# EAGLE design gsm_lora (EAGLE 9.2.0)
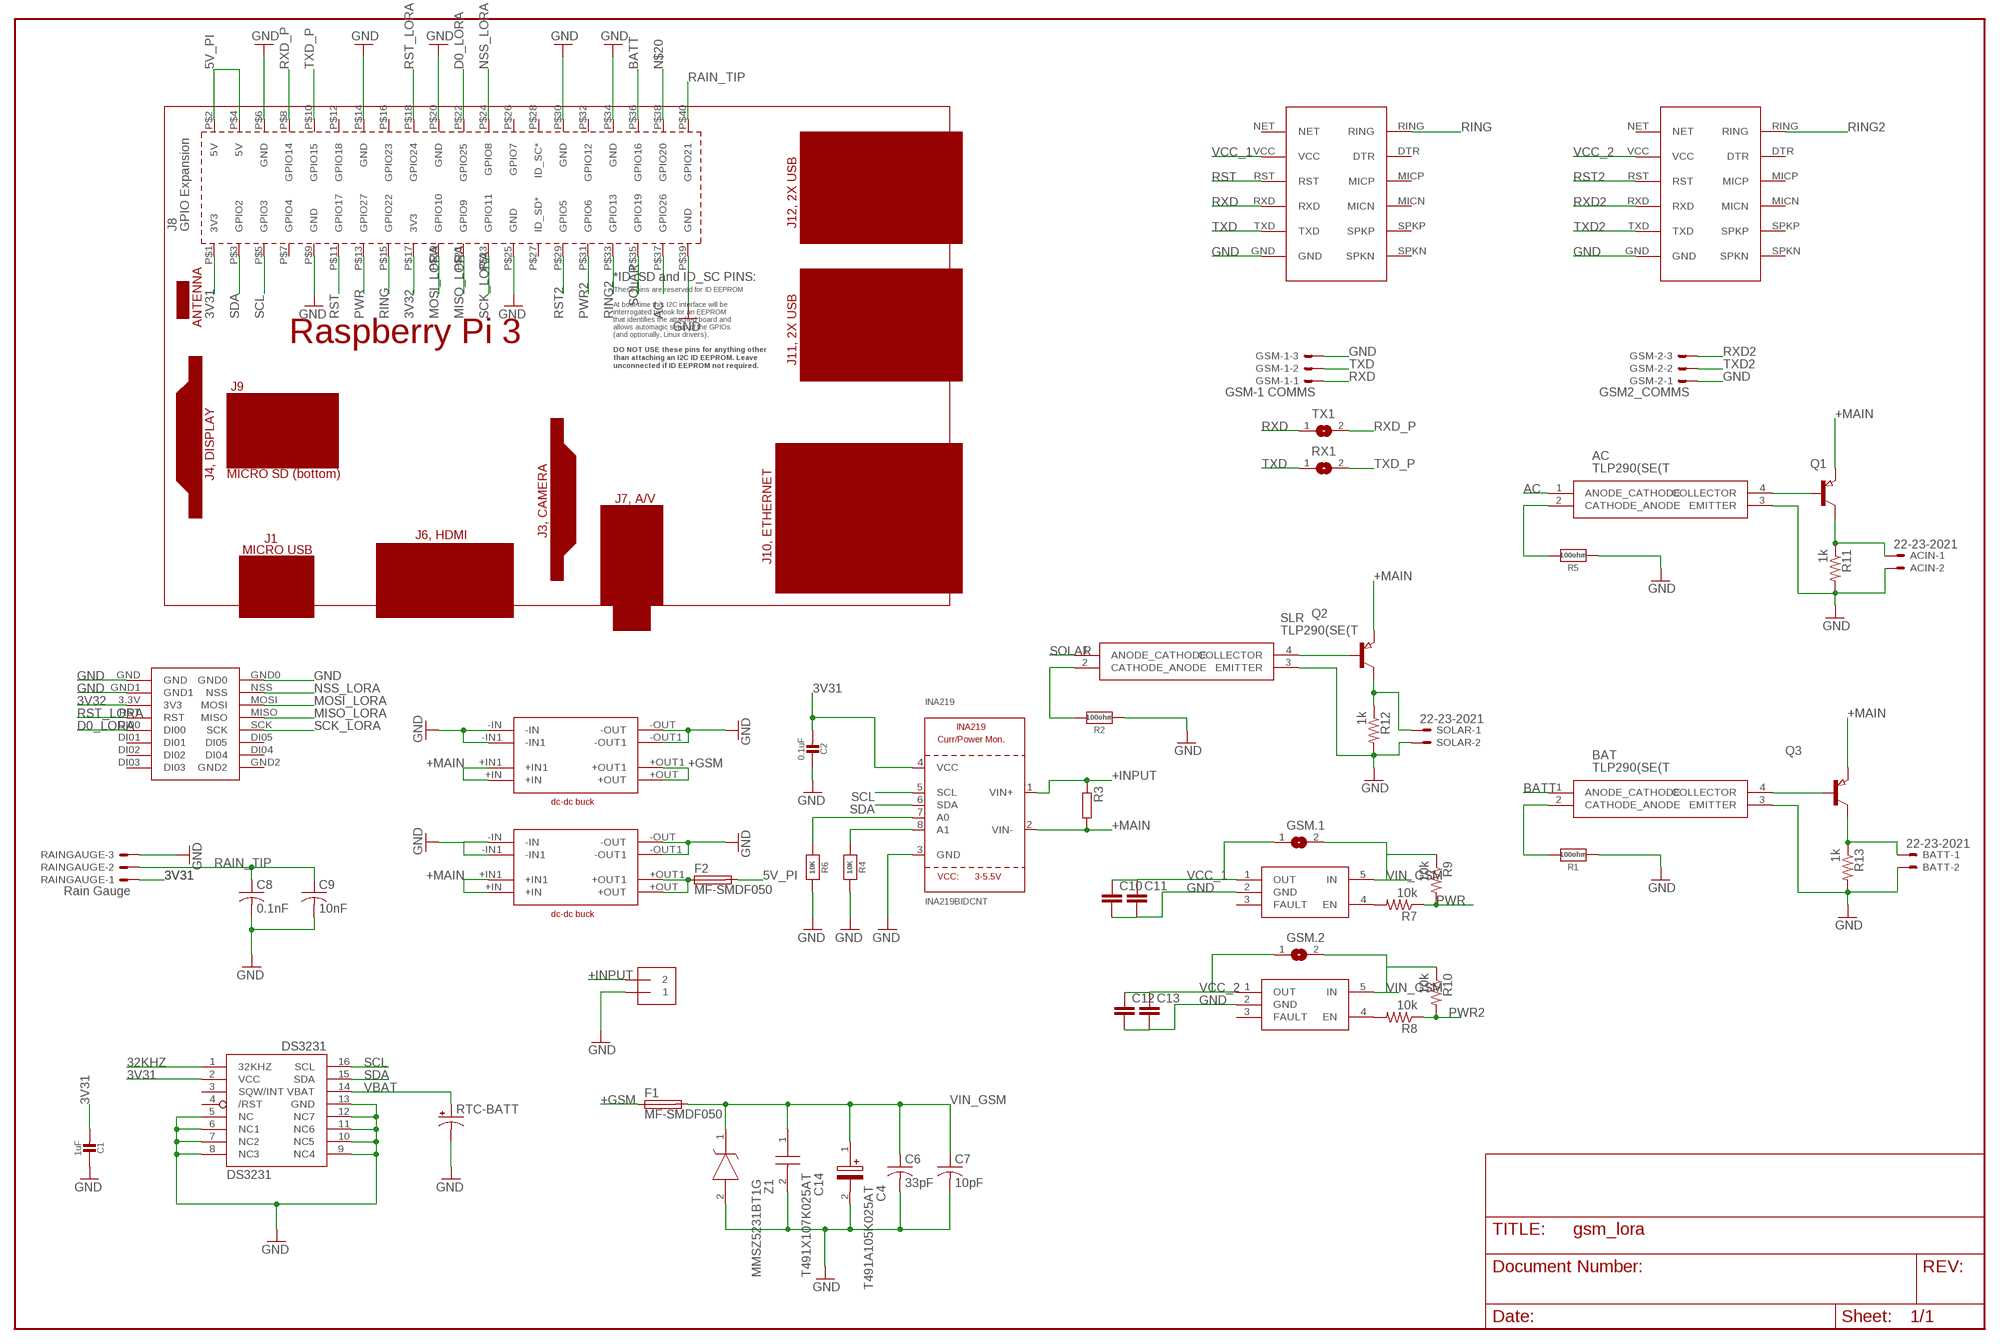
[diagram p0: schematic, sheet 1]

## Parts
AC  TLP290(SE(T  [SOIC127P700X220-4N]
ACIN  22-23-2021  [22-23-2021]
BAT  TLP290(SE(T  [SOIC127P700X220-4N]
BATT  22-23-2021  [22-23-2021]
C1  1uF  CAP_CERAMIC0805-NOOUTLINE  [0805-NO]
C2  0.1uF  CAP_CERAMIC0805-NOOUTLINE  [0805-NO]
C4  T491A105K025AT  [CAPPM3216X180N]
C6  33pF  C-USC0603  [C0603]
C7  10pF  C-USC0603  [C0603]
C8  0.1nF  C-USC0603  [C0603]
C9  10nF  C-USC0603  [C0603]
C10  C-EUC4532  [C4532]
C11  C-EUC4532  [C4532]
C12  C-EUC4532  [C4532]
C13  C-EUC4532  [C4532]
C14  T491X107K025AT  [CAPPM7343X430N]
DS3231  DS3231/SO  [SO16W]
F1  MF-SMDF050  [MF-SMDF050]
F2  MF-SMDF050  [MF-SMDF050]
GSM1  SIM800L_MODULE  [SIM800L]
GSM2  SIM800L_MODULE  [SIM800L]
GSM-1  GSM-1 COMMS  22-23-2031  [22-23-2031]
GSM-2  GSM2_COMMS  22-23-2031  [22-23-2031]
GSM.1  SJ  [SJ]
GSM.2  SJ  [SJ]
INA219  INA219BIDCNT  INA219  [SOT23-8]
POWER  TERMBLOCK_1X2-3.5MM  [1X2-3.5MM]
Q1  PNP-TRANSISTOR_SOT23  [SOT23]
Q2  PNP-TRANSISTOR_SOT23  [SOT23]
Q3  PNP-TRANSISTOR_SOT23  [SOT23]
R1  100ohm  RESISTOR0805_NOOUTLINE  [0805-NO]
R2  100ohm  RESISTOR0805_NOOUTLINE  [0805-NO]
R3  RR2512  [R2512]
R4  10K  RESISTOR0805_NOOUTLINE  [0805-NO]
R5  100ohm  RESISTOR0805_NOOUTLINE  [0805-NO]
R6  10K  RESISTOR0805_NOOUTLINE  [0805-NO]
R7  10k  R-US_R0805  [R0805]
R8  10k  R-US_R0805  [R0805]
R9  10k  R-US_R0805  [R0805]
R10  10k  R-US_R0805  [R0805]
R11  1k  R-US_R0805  [R0805]
R12  1k  R-US_R0805  [R0805]
R13  1k  R-US_R0805  [R0805]
RAINGAUGE  Rain Gauge  22-23-2031  [22-23-2031]
RTC-BATT  CAP_POL1206  [EIA3216]
RX1  SJ  [SJ]
SLR  TLP290(SE(T  [SOIC127P700X220-4N]
SOLAR  22-23-2021  [22-23-2021]
TX1  SJ  [SJ]
U$1  RPI_BARE  [RPI3_BARE]
U$2  STMPS2161STR  [SOT23-5L]
U$3  DC-DC_BUCK_MAD  [DC-DC_BUCK]
U$4  DC-DC_BUCK_MAD  [DC-DC_BUCK]
U$6  RA-02-LORA  [RA-02-LORA]
U$7  STMPS2161STR  [SOT23-5L]
Z1  MMSZ5231BT1G  [SOD3716X135N]

## Nets
3V31: C1.2 C2.2 DS3231.2(VCC) INA219.4(VCC) RAINGAUGE.1 U$1.P$1(3V3)
3V32: U$1.P$17(3V3) U$6.3.3V(3V3)
5V_PI: F2.2 U$1.P$2(5V) U$1.P$4(5V)
32KHZ: DS3231.1(32KHZ)
+GSM: F1.1 U$3.+OUT U$3.+OUT1
+INPUT: INA219.1(VIN+) POWER.2 R3.1
+MAIN: INA219.2(VIN-) Q1.2(E) Q2.2(E) Q3.2(E) R3.2 U$3.+IN U$3.+IN1 U$4.+IN U$4.+IN1
AC: AC.1(ANODE_CATHODE) U$1.P$37(GPIO26)
BATT: BAT.1(ANODE_CATHODE) U$1.P$36(GPIO16)
D0_LORA: U$1.P$22(GPIO25) U$6.DI00
GND: AC.3(EMITTER) ACIN.2 BAT.3(EMITTER) BATT.2 C1.1 C2.1 C4.2(-) C6.2 C7.2 C8.2 C9.2 C10.2 C11.2 C12.2 C13.2 C14.2 DS3231.5(NC) DS3231.6(NC1) DS3231.7(NC2) DS3231.8(NC3) DS3231.9(NC4) DS3231.10(NC5) DS3231.11(NC6) DS3231.12(NC7) DS3231.13(GND) GSM1.GND GSM2.GND GSM-1.3 GSM-2.1 INA219.3(GND) POWER.1 R1.1 R2.1 R4.2 R5.1 R6.2 R11.2 R12.2 R13.2 RAINGAUGE.3 RTC-BATT.C(-) SLR.3(EMITTER) SOLAR.2 U$1.P$6(GND) U$1.P$9(GND) U$1.P$14(GND) U$1.P$20(GND) U$1.P$25(GND) U$1.P$30(GND) U$1.P$34(GND) U$1.P$39(GND) U$2.2(GND) U$3.-IN U$3.-IN1 U$3.-OUT U$3.-OUT1 U$4.-IN U$4.-IN1 U$4.-OUT U$4.-OUT1 U$6.GND U$6.GND0 U$6.GND1 U$7.2(GND) Z1.2(A)
MISO_LORA: U$1.P$21(GPIO9) U$6.MISO
MOSI_LORA: U$1.P$19(GPIO10) U$6.MOSI
N$1: INA219.8(A1) R4.1
N$2: INA219.7(A0) R6.1
N$5: R2.2 SLR.2(CATHODE_ANODE)
N$7: AC.4(COLLECTOR) Q1.1(B)
N$8: ACIN.1 Q1.3(C) R11.1
N$9: BAT.2(CATHODE_ANODE) R1.2
N$10: BAT.4(COLLECTOR) Q3.1(B)
N$11: Q2.1(B) SLR.4(COLLECTOR)
N$12: BATT.1 Q3.3(C) R13.1
N$13: R7.2 U$7.4(EN)
N$14: R8.2 U$2.4(EN)
N$16: AC.2(CATHODE_ANODE) R5.2
N$18: Q2.3(C) R12.1 SOLAR.1
N$20: U$1.P$38(GPIO20)
N$23: F2.1 U$4.+OUT U$4.+OUT1
NSS_LORA: U$1.P$24(GPIO8) U$6.NSS
PWR: R7.1 R9.2 U$1.P$13(GPIO27)
PWR2: R8.1 R10.2 U$1.P$31(GPIO6)
RAIN_TIP: C8.1 C9.1 RAINGAUGE.2 U$1.P$40(GPIO21)
RING: GSM1.RING U$1.P$15(GPIO22)
RING2: GSM2.RING U$1.P$33(GPIO13)
RST: GSM1.RST U$1.P$11(GPIO17)
RST2: GSM2.RST U$1.P$29(GPIO5)
RST_LORA: U$1.P$18(GPIO24) U$6.RST
RXD: GSM1.RXD GSM-1.1 TX1.1
RXD2: GSM2.RXD GSM-2.3
RXD_P: TX1.2 U$1.P$8(GPIO14)
SCK_LORA: U$1.P$23(GPIO11) U$6.SCK
SCL: DS3231.16(SCL) INA219.5(SCL) U$1.P$5(GPIO3)
SDA: DS3231.15(SDA) INA219.6(SDA) U$1.P$3(GPIO2)
SOLAR: SLR.1(ANODE_CATHODE) U$1.P$35(GPIO19)
TXD: GSM1.TXD GSM-1.2 RX1.1
TXD2: GSM2.TXD GSM-2.2
TXD_P: RX1.2 U$1.P$10(GPIO15)
VBAT: DS3231.14(VBAT) RTC-BATT.A(+)
VCC_1: C10.1 C11.1 GSM1.VCC GSM.1.1 U$7.1(OUT)
VCC_2: C12.1 C13.1 GSM2.VCC GSM.2.1 U$2.1(OUT)
VIN_GSM: C4.1(+) C6.1 C7.1 C14.1 F1.2 GSM.1.2 GSM.2.2 R9.1 R10.1 U$2.5(IN) U$7.5(IN) Z1.1(K)
Unconnected: DS3231.3(SQW/INT) DS3231.4(/RST) GSM1.DTR GSM1.MICN GSM1.MICP GSM1.NET GSM1.SPKN GSM1.SPKP GSM2.DTR GSM2.MICN GSM2.MICP GSM2.NET GSM2.SPKN GSM2.SPKP U$1.P$7(GPIO4) U$1.P$12(GPIO18) U$1.P$16(GPIO23) U$1.P$26(GPIO7) U$1.P$27(ID_SD*) U$1.P$28(ID_SC*) U$1.P$32(GPIO12) U$2.3(FAULT) U$6.DI01 U$6.DI02 U$6.DI03 U$6.DI04 U$6.DI05 U$6.GND2 U$7.3(FAULT)

## Library data of the parts
AC BAT SLR = SamacSys_Parts:TLP290(SE(T: Photocoupler, Tr, 2.3mm, AC, SO4 Source: Datasheet <http://uk.rs-online.com/web/p/products/8851086P>; DESCRIPTION: Photocoupler, Tr, 2.3mm, AC, SO4; HEIGHT: 2.2mm; MANUFACTURER_NAME: Toshiba; MANUFACTURER_PART_NUMBER: TLP290(SE(T; RS_PART_NUMBER: 8851086P; RS_PRICE-STOCK: http://uk.rs-online.com/web/p/products/8851086P
ACIN BATT SOLAR = con-molex:22-23-2021: .100" (2.54mm) Center Header - 2 Pin; MF: MOLEX; MPN: 22-23-2021; OC_FARNELL: 1462926; OC_NEWARK: 25C3832
C1 C2 = microbuilder:CAP_CERAMIC: Ceramic Capacitors For new designs, use the packages preceded by an '_' character since they are more reliable: The following footprints should be used on most boards: _0402 - Standard footprint for regular board layouts _0603 - Standard footprint for regular board layouts _0805 - Standard footprint for regular board layouts _1206 - Standard footprint for regular board layouts For extremely tight-pitch boards where space is at a premium, the following 'micro-pitch' footprints can be used (smaller pads, no silkscreen outline, etc.): _0402MP - Micro-pitch footprint for very dense/compact boards _0603MP - Micro-pitch footprint for very dense/compact boards _0805MP - Micro-pitch footprint for very dense/compact boards _1206MP - Micro-pitch footprint for very dense/compact boards
C4 = SamacSys_Parts:T491A105K025AT: Cap Tant Solid 1uF 25V A CASE 10% (3.2 X 1.6 X 1.6mm) SMD 3216-18 8 Ohm 125C Automotive T/R Source: Datasheet <http://uk.rs-online.com/web/p/products/8685769>; ALLIED_NUMBER: 70097127; DESCRIPTION: Cap Tant Solid 1uF 25V A CASE 10% (3.2 X 1.6 X 1.6mm) SMD 3216-18 8 Ohm 125C Automotive T/R; HEIGHT: 1.8mm; MANUFACTURER_NAME: Kemet; MANUFACTURER_PART_NUMBER: T491A105K025AT; RS_PART_NUMBER: 8685769; RS_PRICE-STOCK: http://uk.rs-online.com/web/p/products/8685769
C6-C9 = rcl:C-US: CAPACITOR, American symbol; SPICEPREFIX: C
C10-C13 = rcl:C-EU: CAPACITOR, European symbol; SPICEPREFIX: C
C14 = T491X107K025AT:T491X107K025AT: Capacitor Tantalum T491 Case X 25V 100uF Kemet ??10% 100??F 25 V dc SMD Tantalum Electrolytic Capacitor, X ESR 300m?? +125??C T491 Source: Datasheet <http://uk.rs-online.com/web/p/products/8015511P>; DESCRIPTION: Capacitor Tantalum T491 Case X 25V 100uF Kemet ??10% 100??F 25 V dc SMD Tantalum Electrolytic Capacitor, X ESR 300m?? +125??C T491; HEIGHT: 4.3mm; MANUFACTURER_NAME: Kemet; MANUFACTURER_PART_NUMBER: T491X107K025AT; RS_PART_NUMBER: 8015511P; RS_PRICE-STOCK: http://uk.rs-online.com/web/p/products/8015511P
DS3231 = adafruit:DS3231
F1 F2 = fuse:MF-SMDF: MF-SMDF Series - PRC Resettable Fuses Source: http://www.farnell.com/datasheets/716597.pdf
GSM1 GSM2 = sim800L_module:SIM800L_MODULE
GSM-1 GSM-2 RAINGAUGE = con-molex:22-23-2031: .100" (2.54mm) Center Header - 3 Pin; MF: MOLEX; MPN: 22-23-2031; OC_FARNELL: 1462950; OC_NEWARK: 30C0862
GSM.1 GSM.2 RX1 TX1 = jumper:SJ: SMD solder JUMPER
INA219 = microbuilder:INA219: INA219 - I2C Current/Power Monitor Voltage Range: 0-26V Accuracy: 0.5% Temperature: -40°C - 125°C
POWER = microbuilder:TERMBLOCK_1X2: 3.5mm Terminal block http://www.ladyada.net/library/pcb/eaglelibrary.html
Q1-Q3 = semicon-smd-ipc:PNP-TRANSISTOR_: PNP TRANSISTOR
R1 R2 R4-R6 = microbuilder:RESISTOR: Resistors For new designs, use the packages preceded by an '_' character since they are more reliable: The following footprints should be used on most boards: _0402 - Standard footprint for regular board layouts _0603 - Standard footprint for regular board layouts _0805 - Standard footprint for regular board layouts _1206 - Standard footprint for regular board layouts For extremely tight-pitch boards where space is at a premium, the following 'micro-pitch' footprints can be used (smaller pads, no silkscreen outline, etc.): _0402MP - Micro-pitch footprint for very dense/compact boards _0603MP - Micro-pitch footprint for very dense/compact boards _0805MP - Micro-pitch footprint for very dense/compact boards _1206MP - Micro-pitch footprint for very dense/compact boards
R3 = eagle-ltspice:R: RESISTOR, European symbol; SPICEMODEL: NONE; SPICEPREFIX: R
R7-R13 = rcl:R-US_: RESISTOR, American symbol; SPICEPREFIX: R
RTC-BATT = SparkFun-Passives:CAP_POL: Capacitor Polarized These are standard SMD and PTH capacitors. Normally 10uF, 47uF, and 100uF in electrolytic and tantalum varieties. Always verify the external diameter of the through hole cap, it varies with capacity, voltage, and manufacturer. The EIA devices should be standard.
U$1 = e14_Rpi3_RevA+mirror-pcb:RPI_BARE
U$2 U$7 = stmicro:STMPS2161STR
U$3 U$4 = dc-dc_mad:DC-DC_BUCK_MAD
U$6 = RA-02 LORA Module:RA-02-LORA
Z1 = SamacSys_Parts:MMSZ5231BT1G: 5.1V Zener diode,MMSZ5231B 500mW ON Semiconductor MMSZ5231BT1G Zener Diode, 5.1V 5% 0.5 W SMT 2-Pin SOD-123 Source: Datasheet <http://uk.rs-online.com/web/p/products/5453049P>; ALLIED_NUMBER: 70099546; DESCRIPTION: 5.1V Zener diode,MMSZ5231B 500mW ON Semiconductor MMSZ5231BT1G Zener Diode, 5.1V 5% 0.5 W SMT 2-Pin SOD-123; HEIGHT: 1.35mm; MANUFACTURER_NAME: ON Semiconductor; MANUFACTURER_PART_NUMBER: MMSZ5231BT1G; RS_PART_NUMBER: 5453049P

## Board
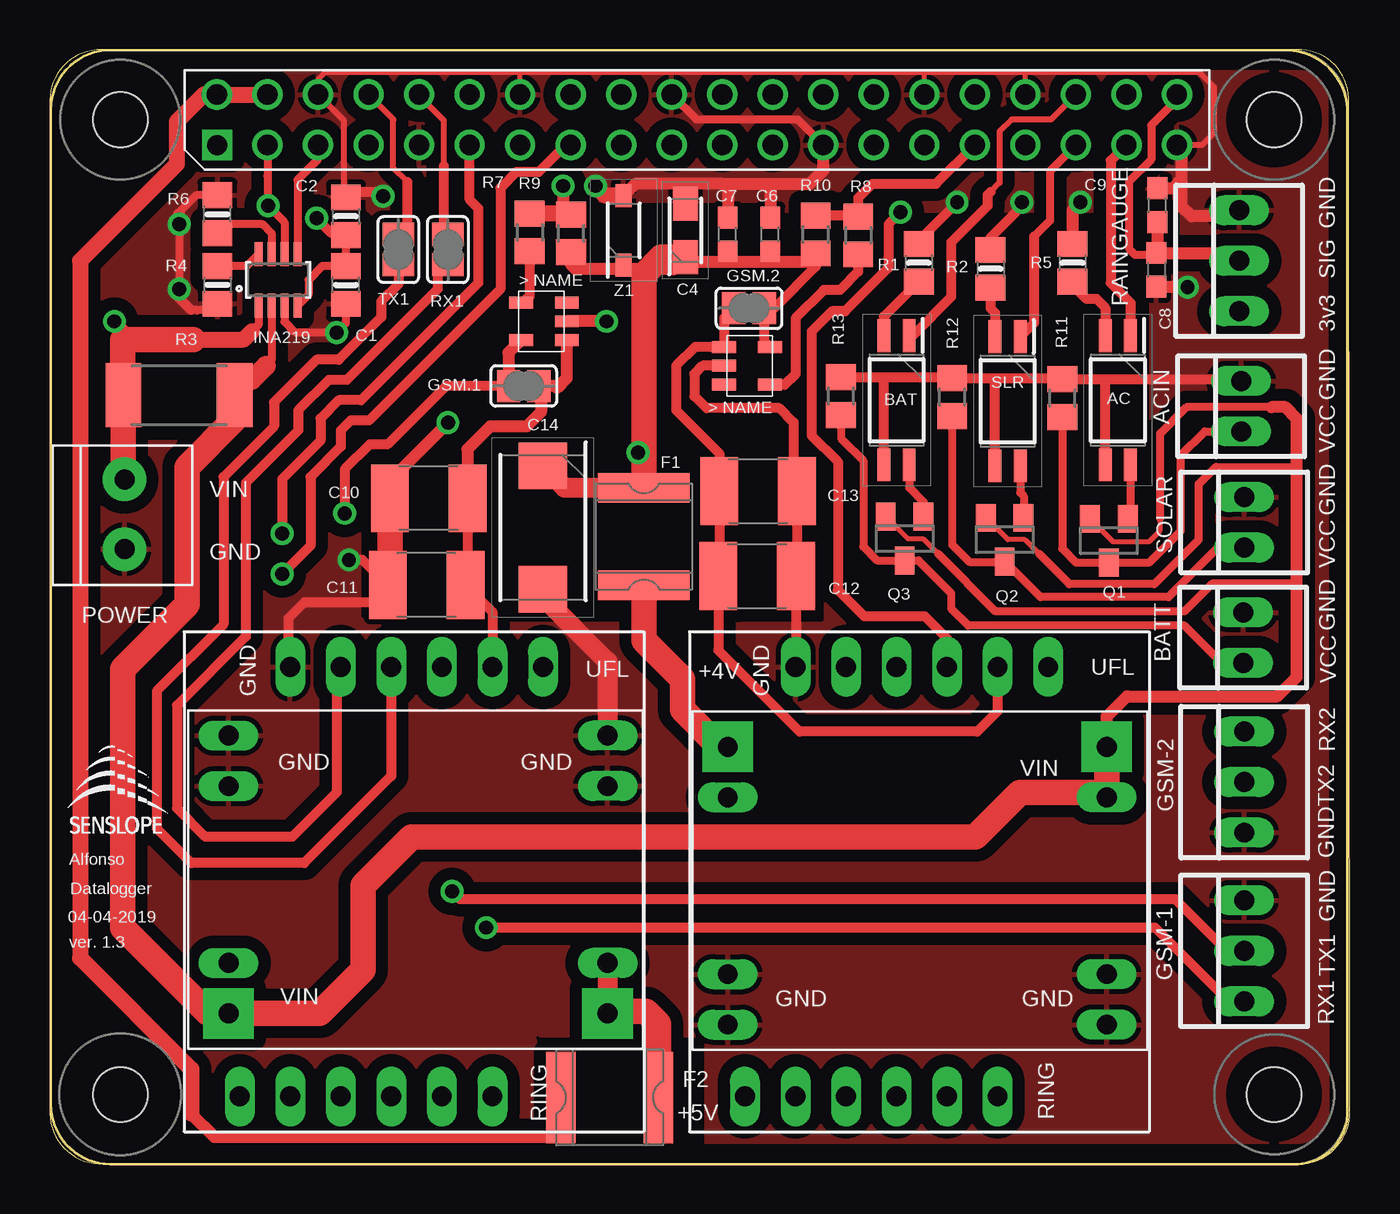
[diagram p1: board, top side]
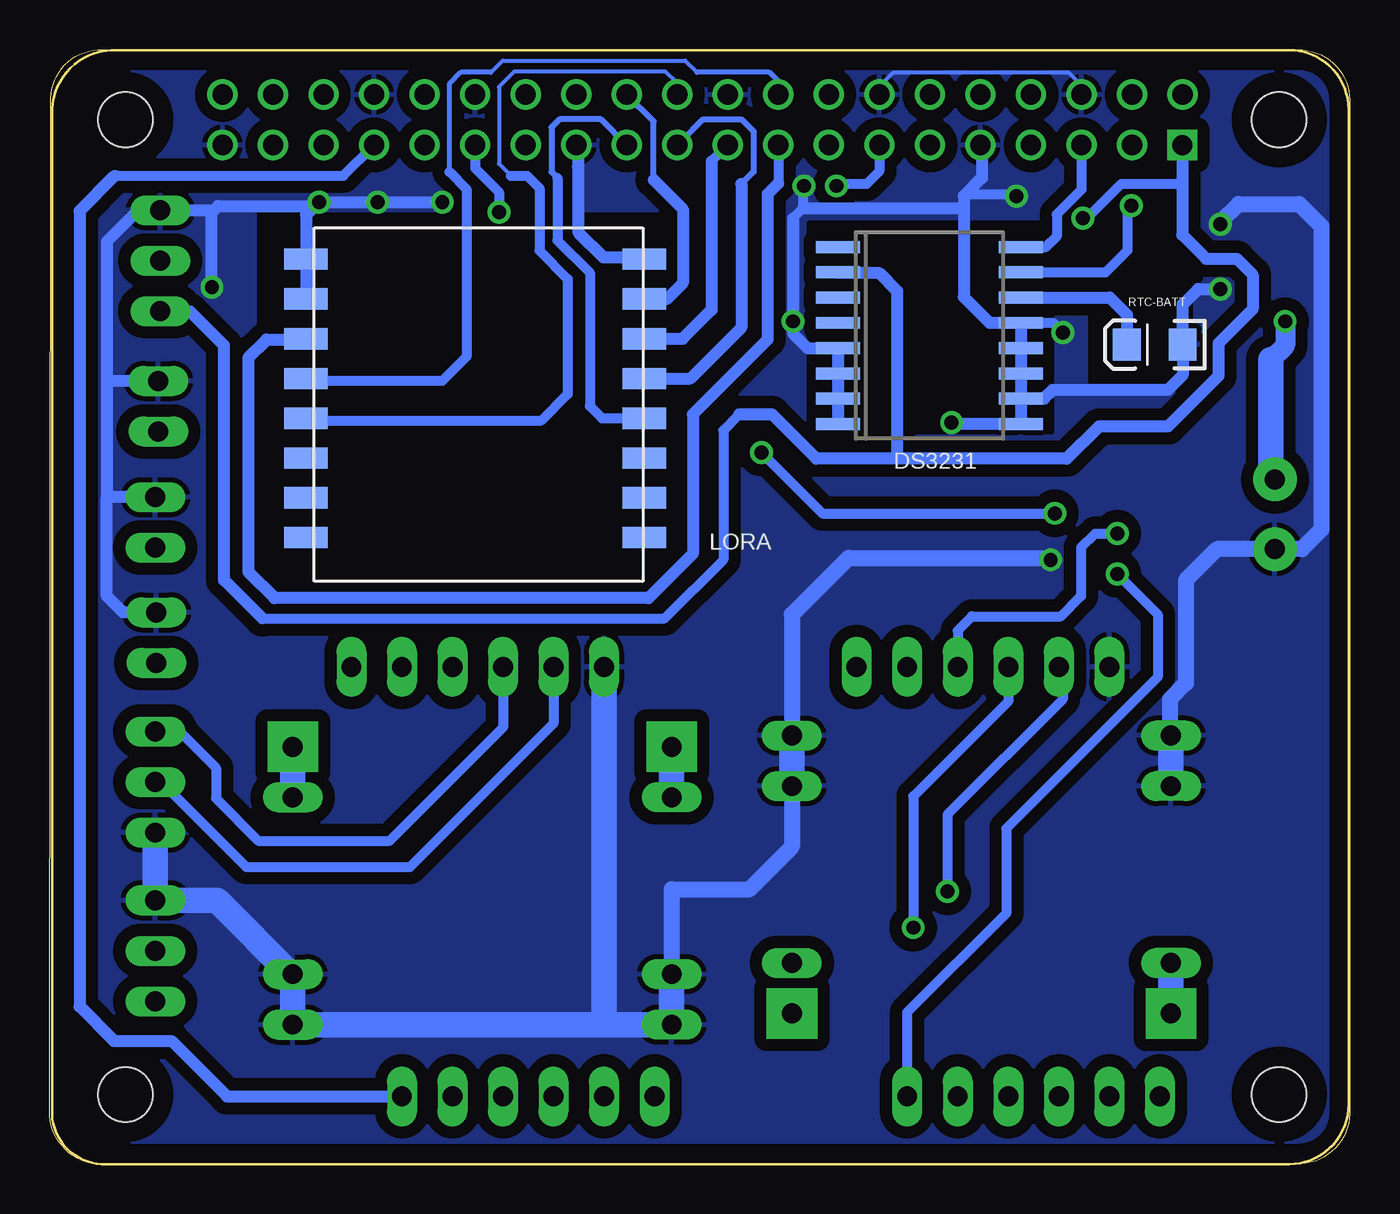
[diagram p2: board, bottom side, seen from below]

Size 65.35 x 56.02 mm. Coordinates in mm from the lower left corner, seen from the top.
Outline: 2.69,0 62.81,0 arc90 65.35,2.64 65.3,53.58 arc90 62.71,56.02 2.59,56.02 arc90 0,53.48 0,2.54 arc90 2.69,0
Copper layers (1*16): Top 0.035mm / dielectric 1.5mm / Bottom 0.035mm
Design rules "default": minimum track width 6mil, minimum drill 0.35mm, track to track 6mil, track to pad 6mil, pad to pad 6mil, via to via 6mil, smd to smd 6mil, copper to edge 40mil, drill to drill 6mil, minimum pad ring 10mil, minimum via ring 8mil, stop-mask expansion 4mil, vias tented up to drill 0mil, thermal gap 10mil

### Footprints (pad centres in the part's own frame; a part is rotated, then mirrored left to right if it is on the bottom)
SOIC127P700X220-4N = smd 1.65 x 0.65: 1 -3.25,0.635; 2 -3.25,-0.635; 3 3.25,-0.635; 4 3.25,0.635
22-23-2021 = drill 1 long: 1 -1.27,0; 2 1.27,0
0805-NO = smd 1.3 x 1.5: 1 -0.95,0; 2 0.95,0
CAPPM3216X180N = smd 1.7 x 1.25: 1 -1.35,0; 2 1.35,0
C0603 = smd 1.1 x 1: 1 -0.85,0; 2 0.85,0
C4532 = smd 1.9 x 3.4: 1 -1.95,0; 2 1.95,0
CAPPM7343X430N = smd 2.35 x 2.45: 1 -3.1,0; 2 3.1,0
SO16W = smd 0.6 x 2.2: 1 -4.445,-4.6; 2 -3.175,-4.6; 3 -1.905,-4.6; 4 -0.635,-4.6; 5 0.635,-4.6; 6 1.905,-4.6; 7 3.175,-4.6; 8 4.445,-4.6; 9 4.445,4.6; 10 3.175,4.6; 11 1.905,4.6; 12 0.635,4.6; 13 -0.635,4.6; 14 -1.905,4.6; 15 -3.175,4.6; 16 -4.445,4.6
MF-SMDF050 = smd 1.5 x 4.6: 1 -2.45,0; 2 2.45,0
SIM800L = drill 1 long: DTR 11.176,1.27; GND -10.414,-6.35; MICN 11.176,-3.81; MICP 11.176,-1.27; NET -10.414,6.35; RING 11.176,3.81; RST -10.414,1.27; RXD -10.414,-1.27; SPKN 11.176,-8.89; SPKP 11.176,-6.35; TXD -10.414,-3.81; VCC -10.414,3.81
22-23-2031 = drill 1 long: 1 -2.54,0; 2 0,0; 3 2.54,0
SJ = smd 1.168 x 1.6: 1 -0.762,0; 2 0.762,0
SOT23-8 = smd 0.4 x 1.2: 1 -0.975,-1.3; 2 -0.325,-1.3; 3 0.325,-1.3; 4 0.975,-1.3; 5 0.975,1.3; 6 0.325,1.3; 7 -0.325,1.3; 8 -0.975,1.3
1X2-3.5MM = drill 1 pad 2.184: 1 1.8,0; 2 -1.7,0
SOT23 = smd 1 x 1.4: 1 -0.95,-1.1; 2 0.95,-1.1; 3 0,1.1
R2512 = smd 1.8 x 3.2: 1 -2.8,0; 2 2.8,0
R0805 = smd 1.3 x 1.5: 1 -0.95,0; 2 0.95,0
EIA3216 = smd 1.4 x 1.6: A 1.4,0; C -1.4,0
RPI3_BARE = drill 1.016 square: P$1 8.37,51.23 | drill 1.016: P$2 8.357,53.772; P$3 10.897,51.232; P$4 10.897,53.772; P$5 13.437,51.232; P$6 13.437,53.772; P$7 15.977,51.232; P$8 15.977,53.772; P$9 18.517,51.232; P$10 18.517,53.772; P$11 21.057,51.232; P$12 21.057,53.772; P$13 23.597,51.232; P$14 23.597,53.772; P$15 26.137,51.232; P$16 26.137,53.772; P$17 28.677,51.232; P$18 28.677,53.772; P$19 31.217,51.232; P$20 31.217,53.772; P$21 33.757,51.232; P$22 33.757,53.772; P$23 36.297,51.232; P$24 36.297,53.772; P$25 38.837,51.232; P$26 38.837,53.772; P$27 41.377,51.232; P$28 41.377,53.772; P$29 43.917,51.232; P$30 43.917,53.772; P$31 46.457,51.232; P$32 46.457,53.772; P$33 48.997,51.232; P$34 48.997,53.772; P$35 51.537,51.232; P$36 51.537,53.772; P$37 54.077,51.232; P$38 54.077,53.772; P$39 56.617,51.232; P$40 56.617,53.772 | hole 2.75: 3.5,3.5; 61.5,3.5; 3.5,52.5; 61.5,52.5
SOT23-5L = smd 0.6 x 1.2: 1 0.95,1.15; 2 0,1.15; 3 -0.95,1.15; 4 -0.95,-1.15; 5 0.95,-1.15
DC-DC_BUCK = drill 1 pad 2.54 square: +IN 7.112,-8.89; +OUT 7.112,10.16 | drill 1 long: +IN1 4.572,-8.89; +OUT1 4.572,10.16; -IN -6.858,-8.89; -IN1 -4.318,-8.89; -OUT -6.858,10.16; -OUT1 -4.318,10.16
RA-02-LORA = smd 2.184 x 1.067: 3.3V -5.5,-0.5; DI00 -5.5,-4.5; DI01 -5.5,-6.5; DI02 -5.5,-8.5; DI03 -5.5,-10.5; DI04 11.5,-8.5; DI05 11.5,-6.5; GND -5.5,3.5; GND0 11.5,3.5; GND1 -5.5,1.5; GND2 11.5,-10.5; MISO 11.5,-2.5; MOSI 11.5,-0.5; NSS 11.5,1.5; RST -5.5,-2.5; SCK 11.5,-4.5
SOD3716X135N = smd 1.15 x 0.8: 1 -1.75,0; 2 1.75,0

### Placement (x,y rotation side)
AC  53.7,38.4 270 top
ACIN  59.89,38.1 90 top
BAT  42.57,38.4 270 top
BATT  59.99,26.47 90 top
C1  14.88,44.2 90 top
C2  14.88,47.65 270 top
C4  31.95,46.94 90 top
C6  36.22,46.74 90 top
C7  34.09,46.74 90 top
C8  55.63,44.96 270 top
C9  55.68,48.21 90 top
C10  19.05,33.48 180 top
C11  18.95,29.11 180 top
C12  35.56,29.57 0 top
C13  35.61,33.83 0 top
C14  24.79,32 270 top
DS3231  21.13,41.66 270 bottom
F1  29.87,31.55 90 top
F2  28.14,3.35 180 top
GSM1  18.44,14.58 270 top
GSM2  43.84,14.58 270 top
GSM-1  60.05,10.72 90 top
GSM-2  60.05,19.2 90 top
GSM.1  23.83,39.12 180 top
GSM.2  35.15,43.03 0 top
INA219  11.48,44.45 0 top
POWER  3.76,32.72 270 top
Q1  53.24,31.34 180 top
Q2  48.01,31.39 180 top
Q3  42.98,31.45 180 top
R1  43.69,45.31 270 top
R2  47.29,45.01 270 top
R3  6.5,38.66 0 top
R4  8.43,44.2 270 top
R5  51.41,45.31 270 top
R6  8.43,47.75 90 top
R7  24.13,46.84 270 top
R8  40.64,46.69 270 top
R9  26.21,46.79 90 top
R10  38.51,46.74 90 top
R11  50.9,38.51 90 top
R12  45.36,38.56 90 top
R13  39.78,38.61 90 top
RAINGAUGE  59.79,45.42 90 top
RTC-BATT  9.8,41.2 180 bottom
RX1  20.02,45.97 90 top
SLR  48.16,38.35 270 top
SOLAR  60.05,32.26 90 top
TX1  17.53,45.97 90 top
U$1  0.05,0 0 top
U$2  35.05,40.13 90 top
U$3  44.25,13.87 90 top
U$4  17.88,14.68 270 top
U$5  [LOGO_SML_TNAME]  3.2,18.25 0 top
U$6  46.97,41.99 0 bottom
U$7  24.84,42.37 270 top
Z1  28.85,46.94 90 top

### Tracks (layer width: path | path; a pad name or v marks a point on that pad's centre or on a via)
3V31  (via drill 0.7 pad 1.15)
  Top 0.406: INA219.4 13,43.7 13,44.45 13.7,45.15 C1.2 C2.2
  Top 0.508: C2.2 14.88,46.8 14.16,46.8 v13.41,47.55
  Bottom 0.508: RAINGAUGE.1 58.32,42.88 | 54.66,27.43 34.44,27.43 31.5,30.38 31.5,36.88 30.68,37.69 | v13.41,47.55 13.21,47.55 11.48,49.28 8.42,49.28
  Bottom 0.61: DS3231.2 25.71,44.81 23.67,44.81 22.76,43.89 22.76,35.46 | 30.68,37.69 29.06,37.69 26.82,35.46 22.76,35.46 | 54.66,27.43 56.59,29.36 56.59,41.15 58.32,42.88 | 22.76,35.46 14.22,35.46 12.6,37.08 9.14,37.08 6.6,39.62 6.6,41.25 4.88,42.98 4.88,44.7 5.69,45.52 7.21,45.52 8.42,46.72 8.42,49.28 U$1.P$1
3V32
  Bottom 0.508: U$1.P$17 28.73,49.3
  Bottom 0.61: U$6.3.3V 52.51,41.45 54.46,41.45 55.37,40.54 55.37,29.77 54.05,28.45 35.25,28.45 33.02,30.68 33.02,37.69 29.26,41.45 29.26,48.77 28.73,49.3
5V_PI
  Top 0.61: 7.11,2.54 8.28,1.37 25.76,1.37 25.69,1.43 F2.2
  Top 0.813: 7.11,2.54 7.11,4.78 1.52,10.36 1.52,45.41 6.4,50.29 6.4,52.43 7.75,53.77 U$1.P$2 U$1.P$4
+GSM
  Top 1.27: F1.1 29.87,26.31 31.8,24.38 31.8,22.86 33.68,20.98 U$3.+OUT
  Bottom 1.27: U$3.+OUT U$3.+OUT1
+INPUT  (via drill 0.7 pad 1.15)
  Top 0.406: INA219.1 10.51,42.2 10.16,41.86
  Top 0.61: v3.25,42.37 3.66,41.96 3.66,41.45
  Top 0.813: 10.16,41.86 9.75,41.45 7.21,41.45
  Top 1.27: POWER.2 3.7,34.47 R3.1 3.66,38.7 3.66,41.45 7.21,41.45
  Bottom 1.016: v3.25,42.37 3.25,41.15 3.96,40.44
  Bottom 1.27: 3.96,40.44 3.96,34.62 POWER.2
+MAIN
  Top 0.254: Q1.2 53.44,31.29 55.27,31.29 55.83,31.85 55.83,32.46 | Q2.2 48.16,31.39 49.02,31.39 49.73,30.68 | Q3.2 43.13,31.45 43.89,31.45 44.65,30.68
  Top 0.406: INA219.2 11.16,40.42 10.87,40.13 | 55.83,32.46 55.83,36.73 57.15,38.05 61.42,38.05 | 49.73,30.68 51.26,29.16 55.52,29.16 57.76,31.39 57.76,34.19 58.62,35.05 62.64,35.05 62.69,35.1 | 44.65,30.68 47.55,27.79 57.05,27.79 58.47,29.21 62.69,29.21
  Top 0.508: U$3.+IN 53.14,19.71
  Top 0.61: U$3.+IN 53.14,22.5 54.15,23.52 61.72,23.52 62.69,24.49 62.69,29.21 62.69,35.1 62.69,37.49 62.13,38.05 61.42,38.05
  Top 1.016: 10.87,40.13 10.16,39.42 9.35,39.42 9.35,38.7 R3.2
  Top 1.27: R3.2 9.3,37.45 6.91,35.05 6.91,28.14 3.66,24.89 3.66,11.89 7.98,7.57 U$4.+IN 13.56,7.57 15.75,9.75 15.75,14.02 18.19,16.46 46.53,16.46 48.77,18.69 52.88,18.69 U$3.+IN1 53.14,19.71
  Bottom 1.27: U$4.+IN1 U$4.+IN | U$3.+IN U$3.+IN1
AC
  Top 0.508: U$1.P$37 53.34,50.44 53.34,44.3 54.33,43.31 AC.1
BATT
  Top 0.305: 47.29,48.87 47.75,49.33 47.75,51.92 48.36,52.53 50.34,52.53 U$1.P$36
  Top 0.508: 47.29,48.87 47.14,48.72 47.14,48.16 45.31,46.33 45.31,43.59 43.38,41.65 BAT.1
D0_LORA
  Bottom 0.203: U$1.P$22 33.81,54.33 34.42,54.94 41.99,54.94 42.77,54.15 42.77,50.29 42.16,49.68
  Bottom 0.508: 42.16,49.68 41.35,49.68 40.74,49.07 40.74,45.92 39.32,44.5 39.32,38.71 40.64,37.39 52.37,37.39 U$6.DI00
GND  (via drill 0.7 pad 1.15)
  Top 0.152: 7.42,42.93 7.39,42.95 | R4.2 8.4,43.21 | 11.84,42.32 11.81,42.35
  Top 0.254: U$1.P$6 13.49,54.53 13.83,54.88 23.67,54.88 | 58.52,54.15 57.79,54.88 49.07,54.88 | 23.67,54.88 43.99,54.88 | 43.99,54.88 49.07,54.88 | U$1.P$30 43.97,54.85 43.99,54.88 | U$1.P$34 49.05,54.85 49.07,54.88 | U$1.P$14 23.65,54.85 23.67,54.88
  Top 0.305: U$1.P$6 14.78,52.48 14.78,48.87 14.78,48.7 C2.1 | 58.52,54.15 58.52,51.82 57.94,51.23 U$1.P$39
  Top 0.406: R6.2 7.35,48.7 6.5,47.85 6.5,47.75 | v6.5,47.24 v6.5,43.99 | 7.39,42.95 7.09,42.95 | 7.42,42.93 8.11,42.93 8.4,43.21 | INA219.3 11.81,42.35 | 11.84,42.32 12.34,41.81 v14.43,41.81 14.88,42.27 C1.1 | U$1.P$25 37.59,52.53 32.51,52.53 U$1.P$20 | RAINGAUGE.3 59.79,47.65 | U$1.P$39 56.9,51
  Top 0.508: U$2.2 32.82,40.13 32.41,39.73 32.41,38.61 33.02,38 36.68,38 37.39,37.29 37.39,34 C13.2 37.56,29.62 C12.2 37.51,25.01 GSM2.GND | GSM1.GND 11.99,24.89 11.99,27.43 12.8,28.25 16.14,28.25 C11.2 15.73,30.38 v15.04,30.38 | 7.09,42.95 6.5,43.54 v6.5,43.99 | v16.76,48.67 16.56,48.87 14.78,48.87 | R1.1 43.69,46.43 v45.62,48.36 | R2.1 47.29,46.58 48.87,48.16 v48.87,48.36 | R13.2 42.06,39.56 | 42.06,39.56 45.31,39.56 R12.2 47.5,39.51 | 47.5,39.51 50.85,39.51 R11.2 53.03,39.46 | 53.03,39.46 59.81,39.46 ACIN.2 | BAT.3 41.93,39.43 42.06,39.56 | SLR.3 47.52,39.48 47.5,39.51 | AC.3 53.06,39.43 53.03,39.46
  Top 0.61: v51.82,48.36 51.41,47.95 R5.1 | v27.99,42.37 U$7.2 | 6.5,47.75 v6.5,47.24 | C10.2 17.1,34.37 v20.02,37.29 | C9.2 56.48,49.06 56.9,49.48 | 56.9,51 56.9,49.48 | C8.2 57.19,44.11 v57.2,44.09 | 56.9,49.48 56.9,48.16 57.4,47.65 59.79,47.65 | Z1.2 29.44,49.28 32,49.28 | 33.83,49.28 32,49.28 | C4.2 31.95,49.22 32,49.28 | C7.2 34.09,49.02 33.83,49.28 | U$1.P$25 38.89,50.01 38.91,49.99 38.2,49.28 36.27,49.28 | 33.83,49.28 36.27,49.28 | C6.2 36.22,49.22 36.27,49.28
  Top 0.813: v27.43,49.17 27.92,48.69 Z1.2
  Top 1.016: C14.2 24.79,28.5 28.04,25.25 U$4.-OUT
  Top 1.27: C10.2 17.1,29.21 C11.2
  Bottom 0.152: 52.47,43.59 U$6.GND1 | 16.53,38.61 DS3231.10 | 16.53,37.39 DS3231.9 | 25.73,37.29 DS3231.8 | 25.73,38.71 DS3231.7 | 25.73,40.03 DS3231.6 | 16.53,41.15 DS3231.12
  Bottom 0.203: U$1.P$6 13.49,54.23 14.12,54.86 22.96,54.86 23.65,54.18 U$1.P$14
  Bottom 0.406: U$1.P$9 18.49,51.16
  Bottom 0.508: 19.3,48.77 16.87,48.77 v16.76,48.67 | v27.43,49.17 27.48,49.12 27.48,48.06 27.99,47.55 | DS3231.13 14.91,42.29 v14.43,41.81 | U$1.P$25 38.79,51.13
  Bottom 0.61: 52.47,43.59 U$6.GND 52.47,47.71 v51.82,48.36 | 16.53,41.15 DS3231.13 18.11,42.29 19.41,43.59 19.41,48.06 | DS3231.12 DS3231.11 16.53,38.61 | 16.53,37.39 DS3231.10 15.37,38.48 14.93,38.91 9.14,38.91 8.4,39.65 RTC-BATT.C 8.4,43.21 7.62,43.99 v6.5,43.99 | 25.73,40.03 DS3231.5 27.25,41.02 27.99,41.76 v27.99,42.37 27.99,47.55 | DS3231.6 25.73,38.71 | DS3231.7 25.73,37.29 | 19.41,48.06 19.41,48.67 19.3,48.77 18.49,49.58 18.49,51.16 | 27.48,48.06 19.41,48.06 | 38.79,51.13 38.79,46.86 37.52,45.59 35.57,45.59 U$6.GND0 | v51.82,48.36 v48.87,48.36 v45.62,48.36 | 57.2,47.95 RAINGAUGE.3 60.91,47.95 62.48,46.38 62.48,39.32 | 57.2,47.95 57.1,47.95 56.9,48.16 52.02,48.16 v51.82,48.36 | DS3231.9 19.94,37.21 v20.02,37.29 | v57.2,44.09 57.2,47.95 | 62.48,39.32 62.48,33.53 | SOLAR.2 62.48,33.53 | ACIN.2 62.43,39.37 62.48,39.32 | BATT.2 61.67,27.74 62.48,28.55 62.48,33.53
  Bottom 0.813: U$4.-OUT 28.04,27.64 25.2,30.48 15.14,30.48 v15.04,30.38 | U$4.-OUT1 28.04,15.95 30.18,13.82 34.09,13.82 U$3.-OUT1 | v6.5,47.24 6.5,47.35 5.59,48.26 2.54,48.26 1.42,47.14 1.42,31.9 2.41,30.91 POWER.1 6.68,30.91 8.23,29.36 8.23,24.18 9.04,23.37 9.04,21.59 U$4.-IN
  Bottom 1.27: U$4.-IN U$4.-IN1 | U$3.-OUT1 U$3.-OUT 37.49,7.01 | U$4.-OUT U$4.-OUT1 | 37.49,7.01 U$3.-IN U$3.-IN1 53.14,9.45 56.95,13.26 GSM-1.3 GSM-2.1 | GSM2.GND 37.49,7.01
  pour Bottom (isolate 0.61): 62.48,0 2.84,0 arc-90 0,2.84 0,53.14 arc-90 2.84,55.98 62.48,55.98 arc-90 65.13,53.34 65.13,2.64 arc-90
  pour Top (isolate 0.61): 62.48,0 2.84,0 arc-90 0,2.84 0,53.14 arc-90 2.84,55.98 62.48,55.98 arc-90 65.23,53.24 65.23,2.74 arc-90
MISO_LORA
  Bottom 0.305: U$1.P$21 33.02,52.02 32.51,52.53 30.58,52.53 29.97,51.92 29.97,49.89 30.58,49.28
  Bottom 0.61: U$6.MISO 33.15,39.49 30.58,42.06 30.58,49.28
MOSI_LORA
  Bottom 0.152: U$6.MOSI 35.46,41.49
  Bottom 0.508: U$1.P$19 32.08,50.42
  Bottom 0.61: 32.08,50.42 32.08,42.95 33.54,41.49 35.46,41.49
N$1
  Top 0.152: 8.64,45.15 R4.1
  Top 0.406: INA219.8 9.9,45.15 8.64,45.15
N$2
  Top 0.152: 8.65,47.02 R6.1 | 10.72,47.24 10.67,47.24
  Top 0.406: INA219.7 11.16,46.81 10.72,47.24 | 10.67,47.24 8.88,47.24 8.65,47.02
N$3
  cutout Top: 2.44,41.45 10.57,41.45 10.57,36.47 2.13,36.47 2.13,41.45 2.64,41.45
N$4
  cutout Top: 34.14,47.75 55.17,47.75 55.17,29.77 33.63,29.77 33.53,29.87 33.53,47.75
N$5
  Top 0.508: SLR.2 47.52,42.8 47.29,43.03 R2.2
N$6
  cutout Bottom: 33.53,47.75 54.76,47.75 54.86,47.85 54.86,30.68 33.53,30.68 33.43,30.78 33.43,47.75
N$7
  Top 0.406: AC.4 54.33,32.59 Q1.1
N$8
  Top 0.406: R11.1 50.9,30.94 51.61,30.23 51.63,30.24 Q1.3 55.29,30.24 56.84,31.8 56.84,35.61 58.06,36.83 ACIN.1
N$9
  Top 0.508: R1.2 41.93,42.61 BAT.2
N$10
  Top 0.406: BAT.4 43.2,34.01 43.93,33.29 Q3.1
N$11
  Top 0.406: SLR.4 48.79,33.76 48.97,33.58 48.97,32.51 Q2.1
N$12
  Top 0.406: BATT.1 58.93,25.2 57.05,27.08 46.18,27.08 45.31,27.94 45.31,28.7 43.67,30.35 Q3.3 41.59,30.35 40.89,31.04 40.89,35.36 39.78,36.47 R13.1
N$13
  Top 0.508: R7.2 24.13,43.64 23.81,43.32 U$7.4
N$14
  Top 0.508: U$2.4 36.95,39.18 37.49,39.73 37.49,42.52 38.91,43.94 39.73,43.94 40.64,44.86 R8.2
N$15
  cutout Bottom: 14.73,47.35 27.23,47.35 27.23,36.78 14.94,36.78 14.94,47.14
N$16
  Top 0.508: AC.2 53.06,43.05 52.63,43.48 52.12,43.48 51.41,44.2 R5.2
N$17
  cutout Top: 15.75,43.79 15.54,43.99 38.81,43.99 38.81,27.33 15.95,27.33 15.75,27.53
N$18
  Top 0.406: R12.1 45.36,31.14 46.23,30.28 47.99,30.28 Q2.3 49.8,28.5 56.24,28.5 58.72,30.99 SOLAR.1
N$19
  cutout Top: 27.33,48.26 35.97,48.26 35.97,45.92 36.37,45.52 27.33,45.52 27.33,48.36 27.43,48.26 27.64,48.26
N$21
  cutout Bottom: 8.03,43.89 7.42,44.5 13.11,44.5 13.11,38.91 8.03,38.91 7.92,39.01 7.92,43.89 8.33,43.89
N$22
  cutout Top: 24.54,6.3 32.72,6.3 32.82,6.2 32.82,0.81 32.77,0.76 32.72,0.71 24.59,0.71 24.59,6.3 24.54,6.35
N$23
  Top 1.016: U$4.+OUT1 U$4.+OUT
  Top 1.27: F2.1 30.59,7.05 29.97,7.67 28.14,7.67 U$4.+OUT
NSS_LORA
  Bottom 0.305: 35,49.48 35,52.43 U$1.P$24
  Bottom 0.61: U$6.NSS 34.33,43.49 33.53,44.3 33.53,48.01 35,49.48
PWR  (via drill 0.7 pad 1.15)
  Top 0.61: v25.81,49.17 25.81,48.14 R9.2
  Top 0.813: R7.1 26.16,47.79 R9.2
  Bottom 0.508: v25.81,49.17 25.71,49.28 24.28,49.28 23.65,49.91 U$1.P$13
PWR2
  Top 0.508: R10.2 40.59,47.69 R8.1 40.64,48.56 41.35,49.28 44.55,49.28 U$1.P$31
RAIN_TIP
  Top 0.406: U$1.P$40 56.67,53.52 55.37,52.22 55.37,50.49 54.25,49.38 54.25,46.02 54.56,45.72 55.54,45.72 C8.1
  Top 0.61: C9.1 55.68,45.86 C8.1 59.4,45.81 RAINGAUGE.2
RING  (via drill 0.7 pad 1.15)
  Top 0.406: U$1.P$15 25.93,51.23
  Top 0.508: v11.68,29.67 13.11,31.09 13.11,34.54 14.63,36.07 14.63,36.88 15.14,37.39 16.05,37.39 22.66,43.99 22.66,49.07 23.47,49.89 24.59,49.89 25.93,51.23
  Bottom 0.508: v11.68,29.67 9.65,27.64 9.65,24.49 17.27,16.87 17.27,12.6 22.25,7.62 GSM1.RING
RING2
  Bottom 0.508: 62.08,49.68 50.6,49.68 U$1.P$33
  Bottom 0.61: 62.08,49.68 63.86,47.9 63.86,7.92 62.13,6.2 59.23,6.2 56.44,3.4 GSM2.RING
RST  (via drill 0.7 pad 1.15)
  Top 0.508: v11.68,31.7 11.68,34.44 13.61,36.37 13.61,37.49 14.53,38.4 15.65,38.4 21.54,44.3 21.54,48.06 21.11,48.49 U$1.P$11
  Bottom 0.508: v11.68,31.7 12.8,31.7 13.51,30.99 13.51,28.55 14.53,27.53 19,27.53 19.71,26.82 GSM1.RST
RST2  (via drill 0.7 pad 1.15)
  Top 0.508: GSM2.RST 45.11,26.42 43.99,27.53 40.95,27.53 39.62,28.85 39.62,35.31 38.3,36.63 38.3,41.86 39.32,42.88 39.98,42.88 42.16,45.06 42.16,47.24 v42.77,47.85
  Bottom 0.508: v42.77,47.85 42.77,48.87 43.97,50.06 U$1.P$29
RST_LORA
  Bottom 0.203: 32.82,54.88 33.41,55.47 42.59,55.47 43.18,54.88
  Bottom 0.254: U$1.P$18 28.73,54.43 29.18,54.88 32.82,54.88 | 43.18,54.88 44.69,54.88 45.26,54.3 45.26,49.89
  Bottom 0.508: 45.26,49.89 44.4,49.02 44.4,40.59 45.62,39.37 52.35,39.37 U$6.RST
RXD  (via drill 0.7 pad 1.15)
  Top 0.508: TX1.1 17.53,44.25 16.66,43.38 16.66,42.57 14.53,40.44 13.41,40.44 11.28,38.3 11.28,37.08 8.74,34.54 8.74,27.13 5.38,23.77 5.38,16.87 7.11,15.14 12.8,15.14 17.17,19.51 GSM1.RXD | GSM-1.1 59.28,8.18 55.57,11.89 v21.95,11.89
  Bottom 0.508: GSM1.RXD 17.17,23.27 21.95,18.49 v21.95,11.89
RXD2
  Bottom 0.508: GSM2.RXD 42.57,21.95 48.26,16.26 54.86,16.26 57,18.39 57,19.91 58.83,21.74 GSM-2.3
RXD_P
  Top 0.305: 17.98,49.38 17.27,50.09 17.27,52.48 17.27,52.53 U$1.P$8
  Top 0.508: 17.98,49.38 17.98,47.19 TX1.2
SCK_LORA
  Bottom 0.305: 39.83,49.58 40.13,49.89 40.13,52.12 39.73,52.53 37.64,52.53 U$1.P$23
  Bottom 0.508: U$6.SCK 37.59,37.49 38.2,38.1 38.2,44.81 39.83,46.43 39.83,49.58
SCL
  Top 0.406: INA219.5 12.46,49.49 13.49,50.52 U$1.P$5
  Bottom 0.508: DS3231.16 15.27,46.1 14.73,46.63 14.73,47.75 13.49,49 U$1.P$5
SDA  (via drill 0.7 pad 1.15)
  Top 0.406: INA219.6 11.81,47.34 v10.97,48.17 | U$1.P$3 10.95,49.68 10.95,48.2
  Top 0.508: v10.97,48.17 10.95,48.2
  Bottom 0.508: DS3231.15 12.27,44.83 11.18,45.92 11.18,47.97 v10.97,48.17
SOLAR
  Top 0.406: 49.48,46.63 50.29,47.45 50.29,49.94 U$1.P$35
  Top 0.508: 49.48,46.63 49.48,42.29 SLR.1
TXD  (via drill 0.7 pad 1.15)
  Top 0.508: RX1.1 19.51,44.7 19.51,43.99 14.93,39.42 14.02,39.42 12.5,37.9 12.5,36.88 9.86,34.24 9.86,26.52 6.4,23.06 6.4,17.88 7.82,16.46 12.19,16.46 14.43,18.69 14.43,24.79 GSM1.TXD | GSM-1.2 59.18,10.72 56.59,13.31 20.62,13.31 v20.22,13.72
  Bottom 0.508: GSM1.TXD 14.43,24.79 14.43,23.37 20.22,17.58 v20.22,13.72
TXD2
  Bottom 0.508: GSM2.TXD 40.03,22.15 47.24,14.93 55.47,14.93 59.74,19.2 GSM-2.2
TXD_P
  Top 0.305: 19.81,50.19 19.81,52.48 18.57,53.72 U$1.P$10
  Top 0.508: 19.81,50.19 19.81,46.94 RX1.2
VBAT
  Bottom 0.61: DS3231.14 12.07,43.56 11.2,42.7 RTC-BATT.A
VCC_1
  Top 0.508: GSM1.VCC 22.25,27.76 C11.1 21,29.21 C10.1
  Top 0.61: U$7.1 25.99,39.5 25.5,39.01 25.4,39.12 GSM.1.1 24.69,39.01 24.69,37.79 23.98,37.08 22.15,37.08 21,35.93 C10.1
VCC_2
  Top 0.508: GSM.2.1 33.9,42.54 U$2.1 32.45,41.08 31.5,40.13 31.5,37.9 33.66,35.73 C13.1 33.66,29.62 C12.1 33.61,25.83 37.69,21.74 46.63,21.74 47.65,22.76 GSM2.VCC
VIN_GSM  (via drill 0.7 pad 1.15)
  Top 0.508: U$2.5 35.92,41.37 GSM.2.2 36.42,43.03 38.51,45.11 38.51,45.52 R10.1 | GSM.1.2 19.91,39.12 16.98,36.18 16.09,36.18 14.83,34.93 v14.83,32.71
  Top 0.61: GSM.1.2 23.06,40.79 U$7.5 | 33.83,45.38 32.16,45.38 C4.1 31.35,44.99 29.06,44.99 Z1.1 28.67,45.01 26.42,45.01 26.21,45.21 R9.1 | C7.1 34.09,45.63 33.83,45.38 | 33.83,45.38 36.27,45.38 | 36.27,45.38 38.37,45.38 38.51,45.52 | C6.1 36.27,45.84 36.27,45.38
  Top 0.813: v29.57,35.76 29.87,35.76
  Top 1.016: F1.2 25.9,34 C14.1
  Top 1.27: F1.2 29.87,35.76 29.87,44.73 30.73,45.59 C4.1
  Bottom 0.508: v14.83,32.71 26.52,32.71 v29.57,35.76

### Text on the board
tNames: GND | SIG | 3v3 | GND | VCC | VIN | GND | GND | VCC | GND | GND | GND | UFL | +4V | UFL | VCC | RX2 | GND | GND | VIN | TX2 | Alfonso | GND | Datalogger | 04-04-2019 | GND | ver. 1.3 | TX1 | VIN | GND | GND | RX1 | RING | +5V | RING
bNames: LORA